# EAGLE design capsenseboard (EAGLE 6.5.0)
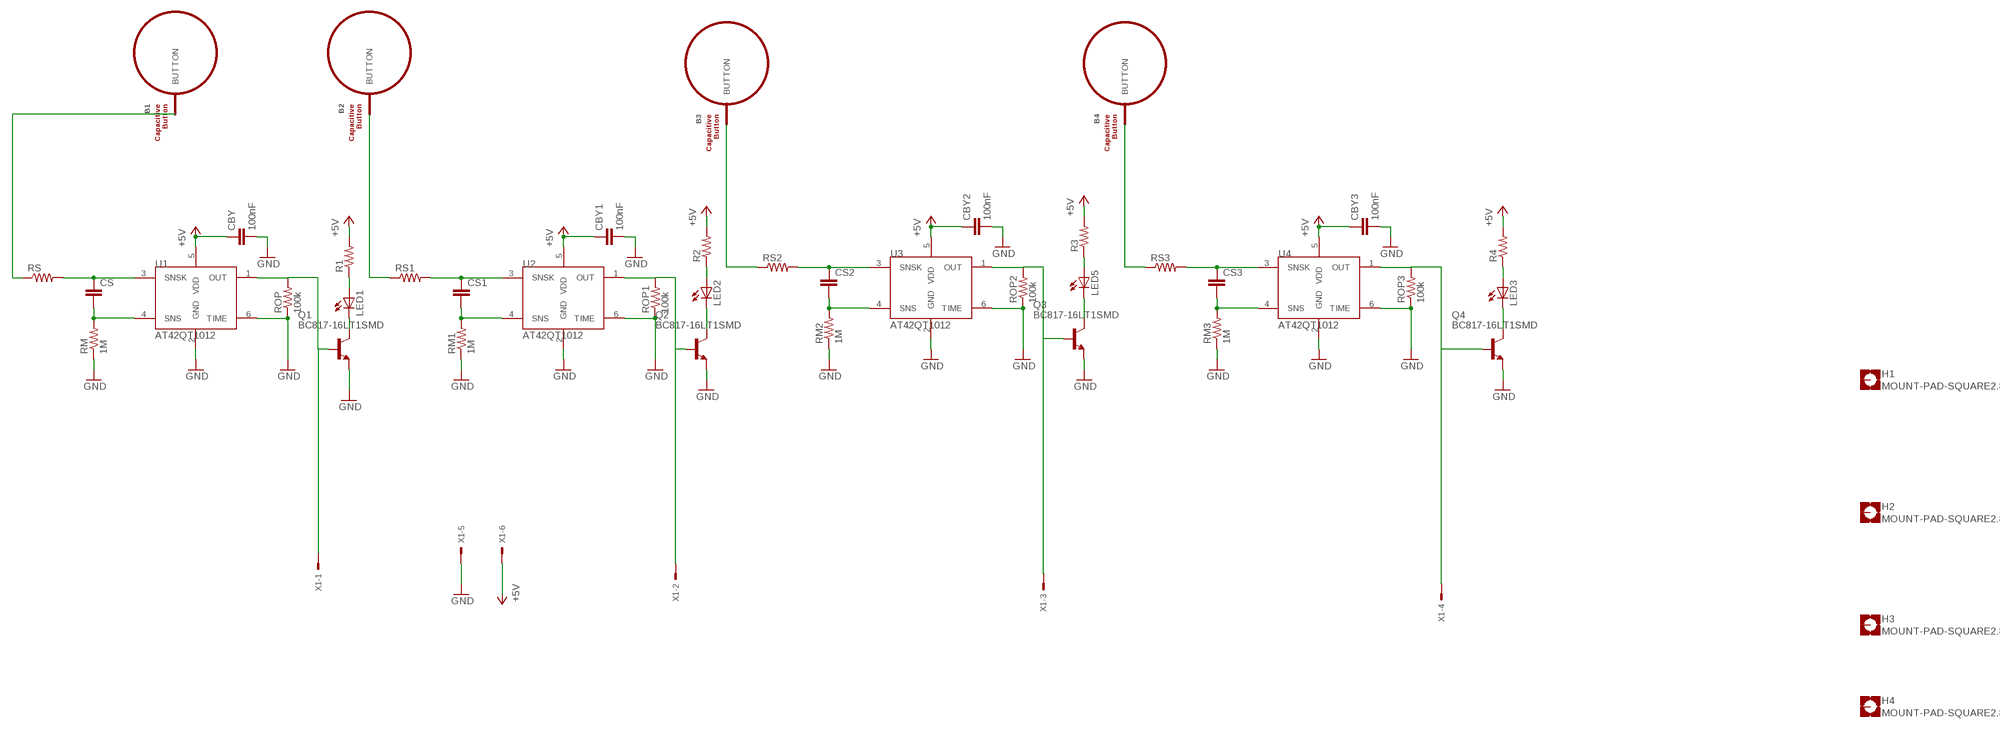
[diagram p0: schematic, sheet 1]

## Parts
B1  BUTTON_PASSIVE12MM  [BUTTON_PASSIVE_12MM]
B2  BUTTON_PASSIVE12MM  [BUTTON_PASSIVE_12MM]
B3  BUTTON_PASSIVE12MM  [BUTTON_PASSIVE_12MM]
B4  BUTTON_PASSIVE12MM  [BUTTON_PASSIVE_12MM]
CBY  100nF  C-EUC1206K  [C1206K]
CBY1  100nF  C-EUC1206K  [C1206K]
CBY2  100nF  C-EUC1206K  [C1206K]
CBY3  100nF  C-EUC1206K  [C1206K]
CS  C-EUC1206K  [C1206K]
CS1  C-EUC1206K  [C1206K]
CS2  C-EUC1206K  [C1206K]
CS3  C-EUC1206K  [C1206K]
H1  MOUNT-PAD-SQUARE2.8  [2,8-PAD-SQUARE]
H2  MOUNT-PAD-SQUARE2.8  [2,8-PAD-SQUARE]
H3  MOUNT-PAD-SQUARE2.8  [2,8-PAD-SQUARE]
H4  MOUNT-PAD-SQUARE2.8  [2,8-PAD-SQUARE]
LED1  LEDCHIPLED_1206  [CHIPLED_1206]
LED2  LEDCHIPLED_1206  [CHIPLED_1206]
LED3  LEDCHIPLED_1206  [CHIPLED_1206]
LED5  LEDCHIPLED_1206  [CHIPLED_1206]
Q1  BC817-16LT1SMD  [SOT23-BEC]
Q2  BC817-16LT1SMD  [SOT23-BEC]
Q3  BC817-16LT1SMD  [SOT23-BEC]
Q4  BC817-16LT1SMD  [SOT23-BEC]
R1  R-US_R1206  [R1206]
R2  R-US_R1206  [R1206]
R3  R-US_R1206  [R1206]
R4  R-US_R1206  [R1206]
RM  1M  R-US_R1206  [R1206]
RM1  1M  R-US_R1206  [R1206]
RM2  1M  R-US_R1206  [R1206]
RM3  1M  R-US_R1206  [R1206]
ROP  100k  R-US_R1206  [R1206]
ROP1  100k  R-US_R1206  [R1206]
ROP2  100k  R-US_R1206  [R1206]
ROP3  100k  R-US_R1206  [R1206]
RS  R-US_R1206  [R1206]
RS1  R-US_R1206  [R1206]
RS2  R-US_R1206  [R1206]
RS3  R-US_R1206  [R1206]
U1  AT42QT1012  [SOT-23-6]
U2  AT42QT1012  [SOT-23-6]
U3  AT42QT1012  [SOT-23-6]
U4  AT42QT1012  [SOT-23-6]
X1  22-23-2061  [22-23-2061]

## Nets
+5V: CBY1.1 CBY2.1 CBY3.1 CBY.1 R1.2 R2.2 R3.2 R4.2 U1.5(VDD) U2.5(VDD) U3.5(VDD) U4.5(VDD) X1.6
GND: CBY1.2 CBY2.2 CBY3.2 CBY.2 Q1.E Q2.E Q3.E Q4.E RM1.1 RM2.1 RM3.1 RM.1 ROP1.1 ROP2.1 ROP3.1 ROP.1 U1.2(GND) U1.6(TIME) U2.2(GND) U2.6(TIME) U3.2(GND) U3.6(TIME) U4.2(GND) U4.6(TIME) X1.5
N$2: CS.1 RS.2 U1.3(SNSK)
N$3: CS.2 RM.2 U1.4(SNS)
N$4: Q1.B ROP.2 U1.1(OUT) X1.1
N$6: B1.BUTTON RS.1
N$8: CS1.1 RS1.2 U2.3(SNSK)
N$9: CS1.2 RM1.2 U2.4(SNS)
N$10: Q2.B ROP1.2 U2.1(OUT) X1.2
N$11: B2.BUTTON RS1.1
N$12: CS2.1 RS2.2 U3.3(SNSK)
N$13: CS2.2 RM2.2 U3.4(SNS)
N$14: Q4.B ROP3.2 U4.1(OUT) X1.4
N$15: B3.BUTTON RS2.1
N$16: CS3.1 RS3.2 U4.3(SNSK)
N$17: CS3.2 RM3.2 U4.4(SNS)
N$19: B4.BUTTON RS3.1
N$21: LED1.A R1.1
N$22: LED1.C Q1.C
N$23: Q3.B ROP2.2 U3.1(OUT) X1.3
N$24: LED5.A R3.1
N$25: LED2.A R2.1
N$26: LED2.C Q2.C
N$27: LED5.C Q3.C
N$28: LED3.A R4.1
N$29: LED3.C Q4.C
Unconnected: H1.B2,8(MOUNT) H2.B2,8(MOUNT) H3.B2,8(MOUNT) H4.B2,8(MOUNT)

## Library data of the parts
B1-B4 = PatternAgents-TouchWidgets:BUTTON_PASSIVE: Button, Passive Capacitive/Touch Sensing Type Source : http://www.PatternAgents.com Github : https://github.com/PatternAgents License : http://creativecommons.org/licenses/by-sa/3.1/ (Creative Commons 3.1) THIS SOFTWARE IS PROVIDED BY THE CONTRIBUTORS "AS IS" AND WITHOUT ANY EXPRESS OR IMPLIED WARRANTIES, INCLUDING, BUT NOT LIMITED TO, THE IMPLIED WARRANTIES OF MERCHANTABILITY AND FITNESS FOR A PARTICULAR PURPOSE ARE DISCLAIMED. IN NO EVENT SHALL THE COPYRIGHT OWNER OR CONTRIBUTORS BE LIABLE FOR ANY DIRECT, INDIRECT, INCIDENTAL, SPECIAL, EXEMPLARY, OR CONSEQUENTIAL DAMAGES (INCLUDING, BUT NOT LIMITED TO, PROCUREMENT OF SUBSTITUTE GOODS OR SERVICES; LOSS OF USE, DATA, OR PROFITS; OR BUSINESS INTERRUPTION) HOWEVER CAUSED AND ON ANY THEORY OF LIABILITY, WHETHER IN CONTRACT, STRICT LIABILITY, OR TORT (INCLUDING NEGLIGENCE OR OTHERWISE) ARISING IN ANY WAY OUT OF THE USE OF THIS SOFTWARE, EVEN IF ADVISED OF THE POSSIBILITY OF SUCH DAMAGE.
CBY CBY1-CBY3 CS CS1-CS3 = rcl:C-EU: CAPACITOR, European symbol
H1-H4 = holes:MOUNT-PAD-SQUARE: MOUNTING PAD, square
LED1-LED3 LED5 = led:LED: LED OSRAM: - CHIPLED LG R971, LG N971, LY N971, LG Q971, LY Q971, LO R971, LY R971 LH N974, LH R974 LS Q976, LO Q976, LY Q976 LO Q996 - Hyper CHIPLED LW Q18S LB Q993, LB Q99A, LB R99A - SideLED LS A670, LO A670, LY A670, LG A670, LP A670 LB A673, LV A673, LT A673, LW A673 LH A674 LY A675 LS A676, LA A676, LO A676, LY A676, LW A676 LS A679, LY A679, LG A679 - Hyper Micro SIDELED® LS Y876, LA Y876, LO Y876, LY Y876 LT Y87S - SmartLED LW L88C, LW L88S LB L89C, LB L89S, LG L890 LS L89K, LO L89K, LY L89K LS L896, LA L896, LO L896, LY L896 - TOPLED LS T670, LO T670, LY T670, LG T670, LP T670 LSG T670, LSP T670, LSY T670, LOP T670, LYG T670 LG T671, LOG T671, LSG T671 LB T673, LV T673, LT T673, LW T673 LH T674 LS T676, LA T676, LO T676, LY T676, LB T676, LH T676, LSB T676, LW T676 LB T67C, LV T67C, LT T67C, LS T67K, LO T67K, LY T67K, LW E67C LS E67B, LA E67B, LO E67B, LY E67B, LB E67C, LV E67C, LT E67C LW T67C LS T679, LY T679, LG T679 LS T770, LO T770, LY T770, LG T770, LP T770 LB T773, LV T773, LT T773, LW T773 LH T774 LS E675, LA E675, LY E675, LS T675 LS T776, LA T776, LO T776, LY T776, LB T776 LHGB T686 LT T68C, LB T68C - Hyper Mini TOPLED® LB M676 - Mini TOPLED Santana® LG M470 LS M47K, LO M47K, LY M47K Source: http://www.osram.convergy.de LUXEON: - LUMILED® LXK2-PW12-R00, LXK2-PW12-S00, LXK2-PW14-U00, LXK2-PW14-V00 LXK2-PM12-R00, LXK2-PM12-S00, LXK2-PM14-U00 LXK2-PE12-Q00, LXK2-PE12-R00, LXK2-PE12-S00, LXK2-PE14-T00, LXK2-PE14-U00 LXK2-PB12-K00, LXK2-PB12-L00, LXK2-PB12-M00, LXK2-PB14-N00, LXK2-PB14-P00, LXK2-PB14-Q00 LXK2-PR12-L00, LXK2-PR12-M00, LXK2-PR14-Q00, LXK2-PR14-R00 LXK2-PD12-Q00, LXK2-PD12-R00, LXK2-PD12-S00 LXK2-PH12-R00, LXK2-PH12-S00 LXK2-PL12-P00, LXK2-PL12-Q00, LXK2-PL12-R00 Source: www.luxeon.com KINGBRIGHT: KA-3528ASYC Source: www.kingbright.com
Q1-Q4 = transistor-npn:BC817*: NPN Transistor
R1-R4 RM RM1-RM3 ROP ROP1-ROP3 RS RS1-RS3 = rcl:R-US_: RESISTOR, American symbol
U1-U4 = SparkFun-Sensors:AT42QT1012: One channel capacitive touch sense
X1 = con-molex:22-23-2061: .100" (2.54mm) Center Header - 6 Pin; MF: MOLEX; MPN: 22-23-2061; OC_FARNELL: 1462922; OC_NEWARK: 27C1933

## Board
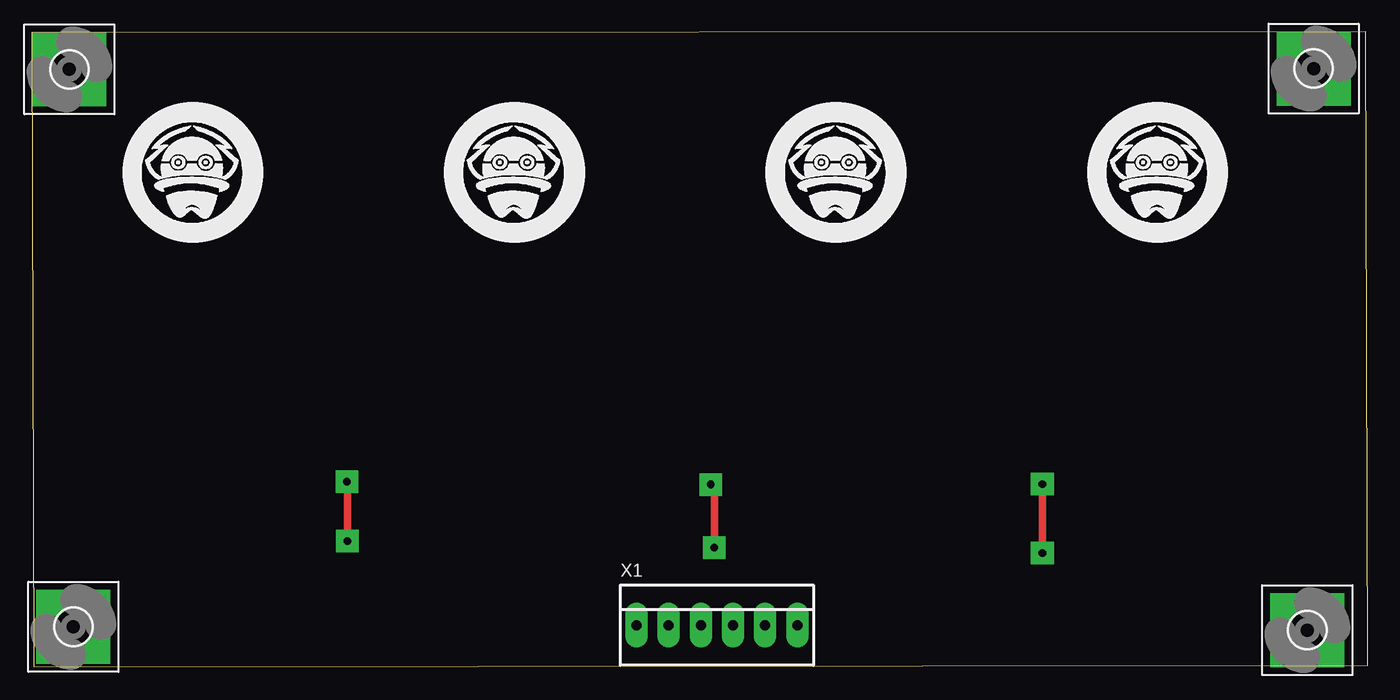
[diagram p1: board, top side]
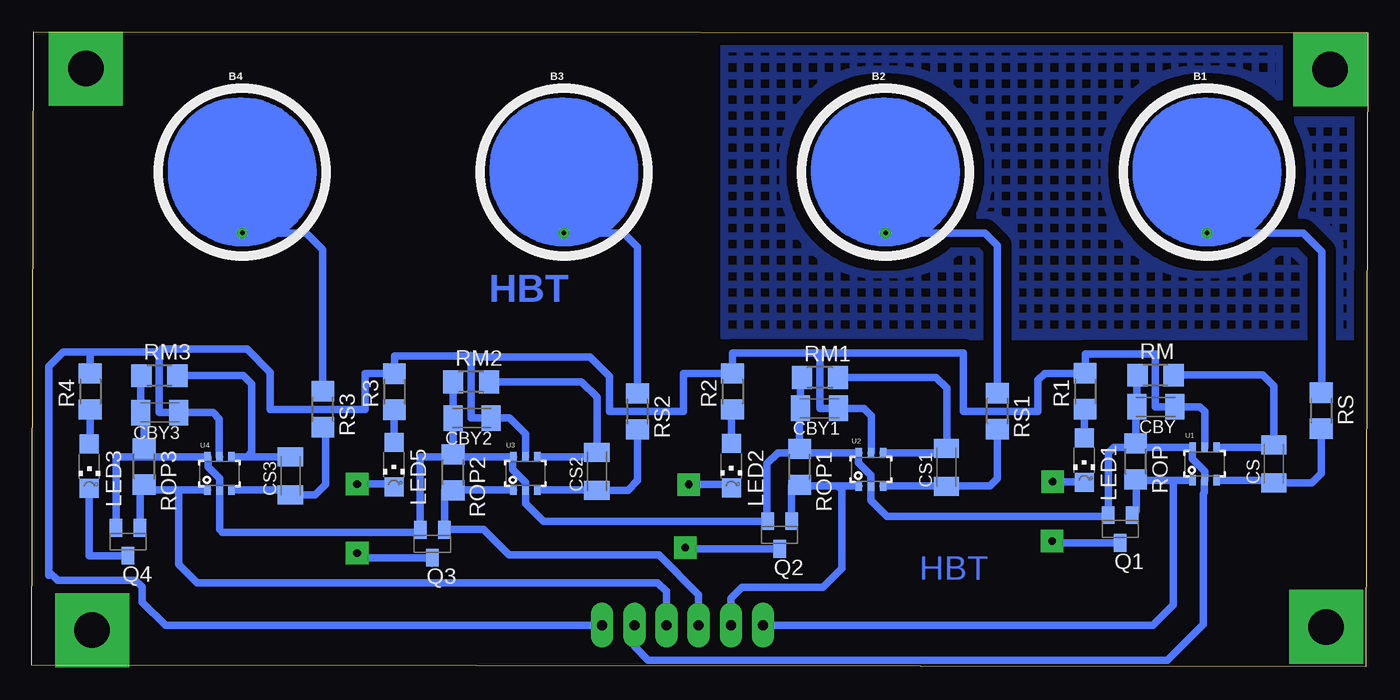
[diagram p2: board, bottom side, seen from below]

Size 105.53 x 50.16 mm. Coordinates in mm from the lower left corner, seen from the top.
Outline: 0.17,0 105.53,0.09 105.36,50.16 0,50.07 0.17,0
Copper layers (1*16): Top 0.035mm / dielectric 1.5mm / Bottom 0.035mm
Design rules "default": minimum track width 10mil, minimum drill 24mil, track to track 8mil, track to pad 8mil, pad to pad 8mil, via to via 8mil, smd to smd 8mil, copper to edge 40mil, drill to drill 8mil, minimum pad ring 10mil, minimum via ring 8mil, stop-mask expansion 4mil, vias tented up to drill 0mil, thermal gap 10mil

### Footprints (pad centres in the part's own frame; a part is rotated, then mirrored left to right if it is on the bottom)
BUTTON_PASSIVE_12MM = drill 0.356: BUTTON 0,4.826
C1206K = smd 1.5 x 2: 1 -1.5,0; 2 1.5,0
2,8-PAD-SQUARE = drill 2.8 pad 5.842 square: B2,8 0,0
CHIPLED_1206 = smd 1.5 x 1.5: A 0,-1.75; C 0,1.75
SOT23-BEC = smd 1 x 1.4: B -0.95,-1.1; C 0,1.1; E 0.95,-1.1
R1206 = smd 1.6 x 1.803: 1 -1.422,0; 2 1.422,0
SOT-23-6 = smd 0.51 x 0.8: 1 -0.95,-1.3; 2 0,-1.3; 3 0.95,-1.3; 4 0.95,1.3; 5 0,1.3; 6 -0.95,1.3
22-23-2061 = drill 0.8 pad 1.778 long: 1 -6.35,0; 2 -3.81,0; 3 -1.27,0; 4 1.27,0; 5 3.81,0; 6 6.35,0

### Placement (x,y rotation side)
B1  12.7,39.09 180 bottom
B2  38.1,39.09 180 bottom
B3  63.5,39.09 180 bottom
B4  88.9,39.09 180 bottom
CBY  16.74,20.53 180 bottom
CBY1  43.31,20.42 180 bottom
CBY2  70.76,19.63 180 bottom
CBY3  95.41,20.07 180 bottom
CS  7.43,16.03 90 bottom
CS1  33.29,15.75 90 bottom
CS2  60.89,15.42 90 bottom
CS3  85.09,15.09 90 bottom
H1  3.29,3.15 0 top
H2  2.98,47.2 0 top
H3  101.26,47.25 0 top
H4  100.75,2.88 0 top
LED1  22.4,16.31 180 bottom
LED2  50.28,15.87 180 bottom
LED3  100.98,15.83 180 bottom
LED5  76.92,15.96 180 bottom
Q1  19.56,10.88 180 bottom
Q2  46.46,10.4 180 bottom
Q3  73.88,9.71 180 bottom
Q4  97.92,9.87 180 bottom
R1  22.33,21.76 90 bottom
R2  50.17,21.73 90 bottom
R3  76.88,21.72 90 bottom
R4  100.9,21.74 90 bottom
RM  16.77,23.03 0 bottom
RM1  43.28,22.85 0 bottom
RM2  70.82,22.5 0 bottom
RM3  95.43,22.99 0 bottom
ROP  18.34,16.21 270 bottom
ROP1  44.88,15.78 270 bottom
ROP2  72.25,15.34 270 bottom
ROP3  96.64,15.81 270 bottom
RS  3.67,20.22 270 bottom
RS1  29.26,20.19 270 bottom
RS2  57.67,20.16 270 bottom
RS3  82.53,20.33 270 bottom
U1  12.89,16.03 0 bottom
U2  39.25,15.58 0 bottom
U3  66.53,15.26 0 bottom
U4  90.69,15.26 0 bottom
X1  54.12,3.27 0 top

### Tracks (layer width: path | path; a pad name or v marks a point on that pad's centre or on a via)
+5V
  Bottom 0.61: U3.5 66.53,18.38 67.78,19.63 CBY2.1 70.83,19.63 70.83,24.53 | U2.5 39.21,16.92 39.21,19.82 39.81,20.42 CBY1.1 43.29,20.42 43.29,24.76 | U1.5 12.89,20.16 13.26,20.53 CBY.1 16.8,20.53 16.8,24.68 22.32,24.68 R1.2 25.51,23.18 26.05,22.64 26.05,20.17 31.96,20.17 31.96,24.76 43.29,24.76 | U4.5 90.7,16.57 90.7,19.58 91.19,20.07 CBY3.1 95.47,20.07 95.47,24.86 | 43.29,24.76 50.17,24.76 R2.2 54.05,23.15 54.05,20.18 59.88,20.18 59.88,22.91 61.44,24.47 70.72,24.47 70.83,24.58 70.83,24.53 | 70.83,24.53 76.88,24.53 R3.2 79.19,23.15 79.19,20.33 86.68,20.33 86.68,23.24 88.51,25.08 95.25,25.08 95.47,24.86 | 95.47,24.86 100.9,24.86 | 100.9,24.86 R4.2 | 104.16,7.22 104.16,7.5 | 104.16,7.5 104.16,23.72 103.03,24.85 100.91,24.85 100.9,24.86 | X1.6 94.96,3.27 96.79,5.1 96.79,6.29 97.33,6.83 103.49,6.83 104.16,7.5
GND
  Bottom 0.61: 72.05,16.56 U3.6 67.56,16.48 67.56,15.58 66.53,14.56 U3.2 66.53,12.91 65.08,11.47 47.44,11.47 Q2.E 47.44,11.53 47.44,16.04 46.59,16.88 44.56,16.88 | 72.05,16.56 ROP2.1 72.25,19.62 CBY2.2 72.27,22.48 RM2.1 | 44.56,16.88 U2.6 40.24,16.84 40.24,16.09 39.25,15.1 U2.2 39.25,13.15 37.98,11.88 20.61,11.88 Q1.E 20.5,16.89 20.07,17.33 18.03,17.33 | 44.56,16.88 ROP1.1 44.88,20.35 CBY1.2 44.81,22.73 RM1.1 | 18.03,17.33 U1.6 13.85,16.4 12.89,15.44 U1.2 12.9,13.76 12.99,13.67 12.99,3.34 15.84,0.49 56.83,0.49 57.93,1.59 X1.5 | 18.03,17.33 ROP.1 18.34,20.44 CBY.2 18.24,22.97 RM.1 | 95.97,16.56 U4.6 91.61,16.52 91.61,15.8 90.69,14.88 U4.2 90.69,10.83 90.49,10.63 75.02,10.63 Q3.E 74.83,16.56 72.05,16.56 | 95.97,16.56 ROP3.1 96.64,19.8 CBY3.2 96.91,22.94 RM3.1 | 95.97,16.56 98.87,16.56 Q4.E
N$2
  Bottom 0.61: U1.3 7.63,14.73 CS.1 4.43,14.53 3.68,15.28 RS.2
N$3
  Bottom 0.61: U1.4 7.63,17.33 CS.2 7.42,22.16 8.29,23.03 RM.2
N$4
  Bottom 0.61: U1.1 15.38,14.73 | 15.38,14.73 18.28,14.73 | 18.28,14.73 ROP.2 | 18.28,14.73 18.28,12.31 Q1.B | X1.1 16.97,3.27 15.38,4.87 15.38,14.73
N$6
  Bottom 0.61: B1.BUTTON 5.1,34.25 3.65,32.8 3.65,21.66 RS.1
N$7
  pour Bottom (isolate 0.813, hatched): 0.34,49.33 50.83,49.33 50.83,26.08 0.16,26.08 0.16,26.48 0.31,26.48 0.31,49.33
N$8
  Bottom 0.61: U2.3 33.32,14.28 | 33.32,14.28 CS1.1 | 33.32,14.28 29.84,14.28 29.26,14.86 RS1.2
N$9
  Bottom 0.61: U2.4 33.66,16.88 CS1.2 33.26,17.28 33.26,22.01 34.1,22.85 RM1.2
N$10
  Bottom 0.61: U2.1 41.87,14.28 | 41.87,14.28 44.8,14.28 | 44.8,14.28 ROP1.2 | 44.8,14.28 45.51,14.28 Q2.B | X1.2 50.31,5.39 49.45,6.25 43.03,6.25 41.54,7.75 41.54,13.95 41.87,14.28
N$11
  Bottom 0.61: B2.BUTTON 30.25,34.26 29.27,33.28 29.27,21.62 RS1.1
N$12
  Bottom 0.61: U3.3 60.93,13.96 CS2.1 58.45,13.92 57.66,14.7 RS2.2
N$13
  Bottom 0.61: RM2.2 62.09,22.49 60.89,21.29 CS2.2 61.25,16.56 U3.4
N$14
  Bottom 0.61: U4.1 94.05,13.96 | 94.05,13.96 96.21,13.96 | 96.21,13.96 ROP3.2 | 96.21,13.96 96.97,13.96 Q4.B | X1.4 55.39,5.95 56.09,6.64 92.44,6.64 93.9,8.1 93.9,13.8 94.05,13.96
N$15
  Bottom 0.61: B3.BUTTON 58.78,34.26 57.66,33.14 RS2.1
N$16
  Bottom 0.61: U4.3 85.46,13.96 CS3.1 83.13,13.59 82.32,14.4 82.32,18.7 RS3.2
N$17
  Bottom 0.61: CS3.2 88.52,16.59 | 88.52,16.59 89.71,16.59 U4.4 | 84.94,16.73 CS3.2 | CS3.2 | RM3.2 88.81,22.99 88.14,22.32 88.14,16.97 88.52,16.59
N$19
  Bottom 0.61: B4.BUTTON 83.86,34.26 82.53,32.93 RS3.1
N$21
  Bottom 0.61: LED1.A 22.4,20.26 R1.1
N$22  (via drill 0.6 pad 1.78)
  Top 0.61: v24.95,9.91 24.95,14.56 v24.89,14.61
  Bottom 0.61: Q1.C 24.82,9.78 v24.95,9.91 | v24.89,14.61 22.45,14.61 LED1.C
N$23
  Bottom 0.61: U3.1 72.21,13.96 ROP2.2 72.93,13.92 Q3.B 72.92,10.83 69.82,10.83 68.9,9.9 68.54,9.54 67.82,8.83 55.99,8.83 52.85,5.68 X1.3
N$24
  Bottom 0.61: LED5.A 76.92,20.26 R3.1
N$25
  Bottom 0.61: LED2.A 50.28,20.2 R2.1
N$26  (via drill 0.6 pad 1.78)
  Top 0.61: v53.91,9.41 53.91,14.13 v53.65,14.39
  Bottom 0.61: 46.52,9.24 Q2.C 53.8,9.3 v53.91,9.41 | v53.65,14.39 50.55,14.39 LED2.C
N$27  (via drill 0.6 pad 1.78)
  Top 0.61: v79.83,8.98 v79.83,14.42
  Bottom 0.61: 73.9,8.15 Q3.C 79.46,8.61 v79.83,8.98 | v79.83,14.42 76.92,14.42 LED5.C
N$28
  Bottom 0.61: LED3.A 100.9,17.58 R4.1
N$29
  Bottom 0.61: LED3.C 100.98,8.77 Q4.C

### Text on the board
Bottom: HBT | HBT